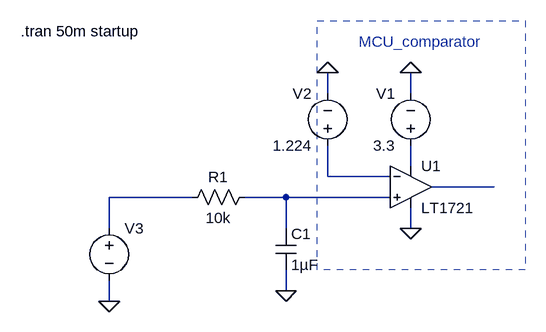
[diagram p0: schematic Button_debounce.asc]
Button_debounce.asc, the LTspice schematic file:
Version 4
SHEET 1 880 680
WIRE 272 -32 272 -64
WIRE 400 -32 400 -64
WIRE 400 80 400 48
WIRE 272 96 272 48
WIRE 368 96 272 96
WIRE 528 112 432 112
WIRE 64 128 -64 128
WIRE 208 128 144 128
WIRE 368 128 208 128
WIRE -64 176 -64 128
WIRE 208 176 208 128
WIRE 400 176 400 144
WIRE 208 272 208 240
WIRE -64 288 -64 256
FLAG 208 272 0
FLAG 400 176 0
FLAG 400 -64 0
FLAG 272 -64 0
FLAG -64 288 0
SYMBOL res 160 112 R90
WINDOW 0 0 56 VBottom 2
WINDOW 3 32 56 VTop 2
SYMATTR InstName R1
SYMATTR Value 10k
SYMBOL cap 192 176 R0
SYMATTR InstName C1
SYMATTR Value 1µF
SYMBOL Comparators\\LT1721 400 48 R0
SYMATTR InstName U1
SYMBOL voltage 400 64 R180
WINDOW 0 24 96 Left 2
WINDOW 3 24 16 Left 2
WINDOW 123 0 0 Left 0
WINDOW 39 0 0 Left 0
SYMATTR InstName V1
SYMATTR Value 3.3
SYMBOL voltage 272 64 R180
WINDOW 0 24 96 Left 2
WINDOW 3 24 16 Left 2
WINDOW 123 0 0 Left 0
WINDOW 39 0 0 Left 0
SYMATTR InstName V2
SYMATTR Value 1.224
SYMBOL voltage -64 160 R0
WINDOW 3 24 96 Invisible 2
WINDOW 123 0 0 Left 0
WINDOW 39 0 0 Left 0
SYMATTR Value PWL(0 0 1m 0V 1.1m 3.3V 1.2m 0.7V 1.3m 3.3V 1.4m 0.2V 1.5m 3.3V)
SYMATTR InstName V3
TEXT -200 -128 Left 2 !.tran 50m startup
TEXT 320 -112 Left 2 ;MCU_comparator
RECTANGLE Normal 576 240 256 -144 2

The netlist it stands for:
* Button_debounce.asc
R1 N005 N004 10k
C1 N005 0 1µF
XU1 N005 N002 N001 0 N003 LT1720  ; LT1721, pins In+ In- V+ V- OUT
V1 N001 0 3.3
V2 N002 0 1.224
V3 N004 0 PWL(0 0 1m 0V 1.1m 3.3V 1.2m 0.7V 1.3m 3.3V 1.4m 0.2V 1.5m 3.3V)
.tran 50m startup
* MCU_comparator
.lib LTC.lib
.backanno
.end